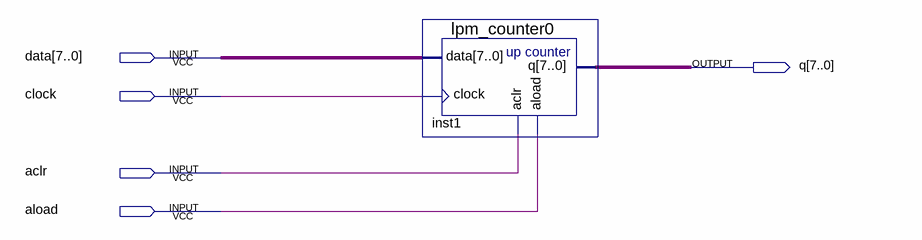
[diagram p0: schematic sheet]
// Quartus schematic lpm_counter2130.bdf as structural Verilog: 1 symbols, 5 pins
module lpm_counter2130 (
  input  [7:0] data,
  input  clock,
  input  aclr,
  input  aload,
  output [7:0] q
);

  lpm_counter0 inst1 (.data(data), .clock(clock), .aclr(aclr), .aload(aload), .q(q));
endmodule
